# Altium project 8CH_RELAY_CARD.PrjPCB
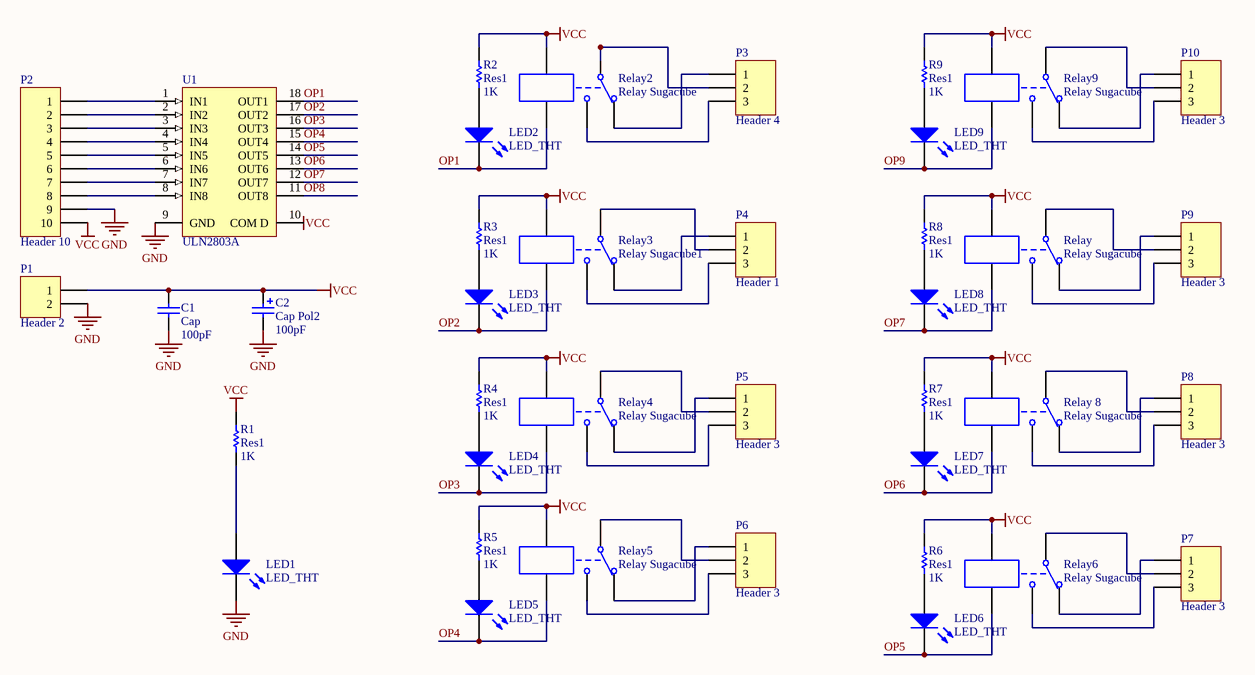
[diagram p0: 8CH_RELAY_CARD.SchDoc]
1 sheet, 39 parts. Net scope: global (net labels, ports and power ports of the same name join across sheets).
Board file: 8CH_RELAY_CARD.PcbDoc

## Sheet 8CH_RELAY_CARD.SchDoc
size A4

### Parts
C1  Cap  value 100pF  [RAD-0.3]
C2  Cap Pol2  value 100pF  [POLAR0.8]
LED1  LED_THT  [3MM_LED]
LED2  LED_THT  [3MM_LED]
LED3  LED_THT  [3MM_LED]
LED4  LED_THT  [3MM_LED]
LED5  LED_THT  [3MM_LED]
LED6  LED_THT  [3MM_LED]
LED7  LED_THT  [3MM_LED]
LED8  LED_THT  [3MM_LED]
LED9  LED_THT  [3MM_LED]
P1  Header 2  [HDR1X2]
P2  Header 10  [HDR1X10]
P3  Header 4  [HDR1X3]
P4  Header 1  [HDR1X3]
P5  Header 3  [HDR1X3]
P6  Header 3  [HDR1X3]
P7  Header 3  [HDR1X3]
P8  Header 3  [HDR1X3]
P9  Header 3  [HDR1X3]
P10  Header 3  [HDR1X3]
R1  Res1  value 1K  [AXIAL-0.3]
R2  Res1  value 1K  [AXIAL-0.3]
R3  Res1  value 1K  [AXIAL-0.3]
R4  Res1  value 1K  [AXIAL-0.3]
R5  Res1  value 1K  [AXIAL-0.3]
R6  Res1  value 1K  [AXIAL-0.3]
R7  Res1  value 1K  [AXIAL-0.3]
R8  Res1  value 1K  [AXIAL-0.3]
R9  Res1  value 1K  [AXIAL-0.3]
Relay  Relay Sugacube  [Relay_Sugarcube]
Relay2  Relay Sugacube  [Relay_Sugarcube]
Relay3  Relay Sugacube1  [Relay_Sugarcube]
Relay4  Relay Sugacube  [Relay_Sugarcube]
Relay5  Relay Sugacube  [Relay_Sugarcube]
Relay6  Relay Sugacube  [Relay_Sugarcube]
Relay9  Relay Sugacube  [Relay_Sugarcube]
Relay_8  Relay Sugacube  [Relay_Sugarcube]
U1  ULN2803A  [A18]

### Nets
GND: C1.1 C2.2 LED1.2(K) P1.2 P2.9 U1.9(GND)
VCC: C1.2 C2.1 P1.1 P2.10 R1.2 R2.2 R3.2 R4.2 R5.2 R6.2 R7.2 R8.2 R9.2 Relay.4 Relay2.4 Relay3.4 Relay4.4 Relay5.4 Relay6.4 Relay9.4 Relay_8.4
OP1: LED2.2(K) Relay2.5 U1.18(OUT1)
OP2: LED3.2(K) Relay3.5 U1.17(OUT2)
OP3: LED4.2(K) Relay4.5 U1.16(OUT3)
OP4: LED5.2(K) Relay5.5 U1.15(OUT4)
OP5: LED6.2(K) Relay6.5 U1.14(OUT5)
OP6: LED7.2(K) Relay_8.5 U1.13(OUT6)
OP7: LED8.2(K) Relay.5 U1.12(OUT7)
OP8: U1.11(OUT8)
OP9: LED9.2(K) Relay9.5
NetLED1_1: LED1.1(A) R1.1
NetLED2_1: LED2.1(A) R2.1
NetLED3_1: LED3.1(A) R3.1
NetLED4_1: LED4.1(A) R4.1
NetLED5_1: LED5.1(A) R5.1
NetLED6_1: LED6.1(A) R6.1
NetLED7_1: LED7.1(A) R7.1
NetLED8_1: LED8.1(A) R8.1
NetLED9_1: LED9.1(A) R9.1
NetP2_1: P2.1 U1.1(IN1)
NetP2_2: P2.2 U1.2(IN2)
NetP2_3: P2.3 U1.3(IN3)
NetP2_4: P2.4 U1.4(IN4)
NetP2_5: P2.5 U1.5(IN5)
NetP2_6: P2.6 U1.6(IN6)
NetP2_7: P2.7 U1.7(IN7)
NetP2_8: P2.8 U1.8(IN8)
NetP3_1: P3.1 Relay2.2
NetP3_2: P3.2 Relay2.1
NetP3_3: P3.3 Relay2.3
NetP4_1: P4.1 Relay3.2
NetP4_2: P4.2 Relay3.1
NetP4_3: P4.3 Relay3.3
NetP5_1: P5.1 Relay4.2
NetP5_2: P5.2 Relay4.1
NetP5_3: P5.3 Relay4.3
NetP6_1: P6.1 Relay5.2
NetP6_2: P6.2 Relay5.1
NetP6_3: P6.3 Relay5.3
NetP7_1: P7.1 Relay6.2
NetP7_2: P7.2 Relay6.1
NetP7_3: P7.3 Relay6.3
NetP8_1: P8.1 Relay_8.2
NetP8_2: P8.2 Relay_8.1
NetP8_3: P8.3 Relay_8.3
NetP9_1: P9.1 Relay.2
NetP9_2: P9.2 Relay.1
NetP9_3: P9.3 Relay.3
NetP10_1: P10.1 Relay9.2
NetP10_2: P10.2 Relay9.1
NetP10_3: P10.3 Relay9.3

Not connected (* = marked no-connect by the designer): U1 10(COM_D)

### Notes on the sheet
- Labels drawn without touching a wire or pin: VCC

### Library data of the parts
C1 = Cap: Capacitor; Published: 8-Jun-2000; LatestRevisionDate: 17-Jul-2002; LatestRevisionNote: Re-released for DXP Platform.; PackageReference: RAD-0.3; Publisher: Altium Limited
C2 = Cap Pol2: Polarized Capacitor (Axial); Published: 8-Jun-2000; LatestRevisionDate: 17-Jul-2002; LatestRevisionNote: Re-released for DXP Platform.; PackageReference: POLAR0.8; Publisher: Altium Limited
LED1-LED9 = LED_THT: Color: Red
P1 = Header 2: Header, 2-Pin; LatestRevisionDate: 17-Jul-2002; LatestRevisionNote: Re-released for DXP Platform.; Publisher: Altium Limited
P2 = Header 10: Header, 10-Pin; LatestRevisionDate: 17-Jul-2002; LatestRevisionNote: Re-released for DXP Platform.; Publisher: Altium Limited
P3-P10 = Header 3: Header, 3-Pin; LatestRevisionDate: 17-Jul-2002; LatestRevisionNote: Re-released for DXP Platform.; Publisher: Altium Limited
R1-R9 = Res1: Resistor; Published: 8-Jun-2000; LatestRevisionDate: 17-Jul-2002; LatestRevisionNote: Re-released for DXP Platform.; PackageReference: AXIAL-0.3; Publisher: Altium Limited
Relay Relay2-Relay6 Relay9 Relay_8 = Relay Sugacube: Coil Voltage: 12V
U1 = ULN2803A: High-Voltage, High-Current Darlington Array; Published: 13-Oct-2000; LatestRevisionDate: 06-Jun-2005; LatestRevisionNote: Stylized 3D Model Added.; DatasheetVersion: 1999; PackageVersion: 1999; PackageReference: A18; Publisher: Altium Limited; PackageDescription: DIP; 18 Leads; Row Spacing 7.62 mm; Pitch 2.54 mm; ComponentLink1Description: Manufacturer Link; ComponentLink1URL: http://www.allegromicro.com/